# EAGLE design ChannelOutput-x2 (EAGLE 6.5.0)

## Sheet 1 of 2
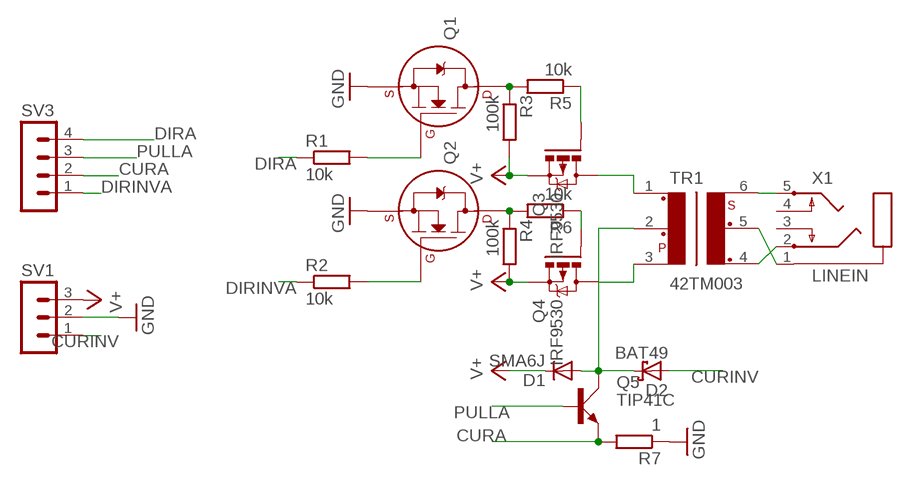
[diagram p0: schematic, sheet 1]

### Parts
D1  SMA6J  1N4004  [DO41-10]
D2  BAT49  [DO41-10]
Q1  2N7000_TO92  [TO-92]
Q2  2N7000_TO92  [TO-92]
Q3  IRF9530  [TO220BV]
Q4  IRF9530  [TO220BV]
Q5  TIP41C  [TO220AV]
R1  10k  R-EU_0207/2V  [0207/2V]
R2  10k  R-EU_0207/2V  [0207/2V]
R3  100k  R-EU_0204/5  [0204/5]
R4  100k  R-EU_0204/5  [0204/5]
R5  10k  R-EU_0207/2V  [0207/2V]
R6  10k  R-EU_0207/2V  [0207/2V]
R7  1  R-EU_0207/2V  [0207/2V]
SV1  MA03-1  [MA03-1]
SV3  MA04-1  [MA04-1]
TR1  42TM003  [42TM]
X1  LINEIN  PG203J  [PG203J]

### Nets
CURA: Q5.E R7.2 SV3.2
CURINV: D2.A SV1.1 ; also sheet 2
DIRA: R1.1 SV3.4
DIRINVA: R2.1 SV3.1
GND: Q1.1(S) Q2.1(S) R7.1 SV1.2 ; also sheet 2
N$1: Q1.2(G) R1.2
N$2: Q4.G R6.1
N$5: Q4.D TR1.3
N$6: Q3.D TR1.1
N$48: D1.A D2.C Q5.C TR1.2
N$65: TR1.6 X1.5
N$66: TR1.5 X1.1
N$67: TR1.4 X1.2
N$86: Q2.3(D) R4.1 R6.2
N$88: Q3.G R5.1
N$89: Q1.3(D) R3.1 R5.2
N$93: Q2.2(G) R2.2
PULLA: Q5.B SV3.3
V+: D1.C Q3.S Q4.S R3.2 R4.2 SV1.3 ; also sheet 2
Unconnected: X1.3 X1.4

## Sheet 2 of 2
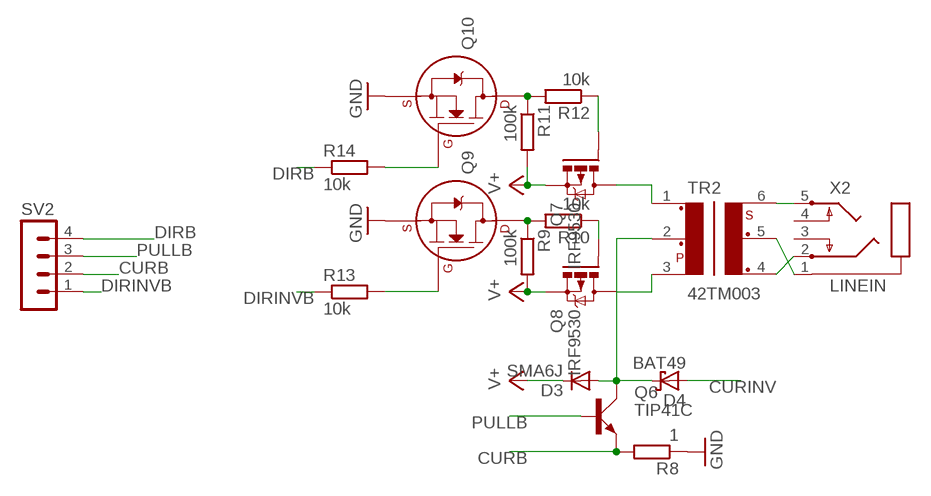
[diagram p1: schematic, sheet 2]

### Parts
D3  SMA6J  1N4004  [DO41-10]
D4  BAT49  [DO41-10]
Q6  TIP41C  [TO220AV]
Q7  IRF9530  [TO220BV]
Q8  IRF9530  [TO220BV]
Q9  2N7000_TO92  [TO-92]
Q10  2N7000_TO92  [TO-92]
R8  1  R-EU_0207/2V  [0207/2V]
R9  100k  R-EU_0204/5  [0204/5]
R10  10k  R-EU_0207/2V  [0207/2V]
R11  100k  R-EU_0204/5  [0204/5]
R12  10k  R-EU_0207/2V  [0207/2V]
R13  10k  R-EU_0207/2V  [0207/2V]
R14  10k  R-EU_0207/2V  [0207/2V]
SV2  MA04-1  [MA04-1]
TR2  42TM003  [42TM]
X2  LINEIN  PG203J  [PG203J]

### Nets
CURB: Q6.E R8.2 SV2.2
CURINV: D4.A ; also sheet 1
DIRB: R14.1 SV2.4
DIRINVB: R13.1 SV2.1
GND: Q9.1(S) Q10.1(S) R8.1 ; also sheet 1
N$8: D3.A D4.C Q6.C TR2.2
N$9: TR2.6 X2.5
N$10: TR2.5 X2.1
N$11: TR2.4 X2.2
N$13: Q9.3(D) R9.1 R10.2
N$15: Q7.G R12.1
N$16: Q10.3(D) R11.1 R12.2
N$17: Q9.2(G) R13.2
N$19: Q8.G R10.1
N$20: Q10.2(G) R14.2
N$23: Q8.D TR2.3
N$24: Q7.D TR2.1
PULLB: Q6.B SV2.3
V+: D3.C Q7.S Q8.S R9.2 R11.2 ; also sheet 1
Unconnected: X2.3 X2.4

## Library data of the parts
D1 D3 = diode:1N4004: DIODE general purpose rectifier, 1 A
D2 D4 = diode:BAT49: DIODE small signal diode
Q1 Q2 Q9 Q10 = transistors2:2N700*: 2N7000, 2N7002, NDS7002A N-channel enhancement mode MOSFET
Q3 Q4 Q7 Q8 = transistor-power:IRF9530: P-CHANNEL HEXFET POWER-MOS-FET Source: http://www.irf.com/product-info/datasheets/data/irf9530.pdf
Q5 Q6 = transistor-power:TIP41C: NPN TRANSISTOR
R1-R14 = resistor:R-EU_: RESISTOR, European symbol
SV1 = con-lstb:MA03-1: PIN HEADER; OC_FARNELL: unknown; OC_NEWARK: unknown
SV2 SV3 = con-lstb:MA04-1: PIN HEADER; OC_FARNELL: unknown; OC_NEWARK: unknown
TR1 TR2 = trafo-xicon:42T?*: Xicon Micro-Mini EI-12 Audio Transformers 42TL/42TC/42TM Series Source: http://www.mouser.com//catalog/specsheets/164201.pdf http://www.mouser.com/catalog/specsheets/114225.pdf http://www.mouser.com/catalog/specsheets/164267.pdf; OC_FARNELL: unknown; OC_NEWARK: unknown
X1 X2 = con-hirschmann:PG203J: MIC/HEADPHONE JACK KS-S stereo microphone/headphone jack PG203JN (Schukat); OC_FARNELL: unknown; OC_NEWARK: unknown

## Net classes
0 default: width 0.305 mm, clearance 0.205 mm

## Board
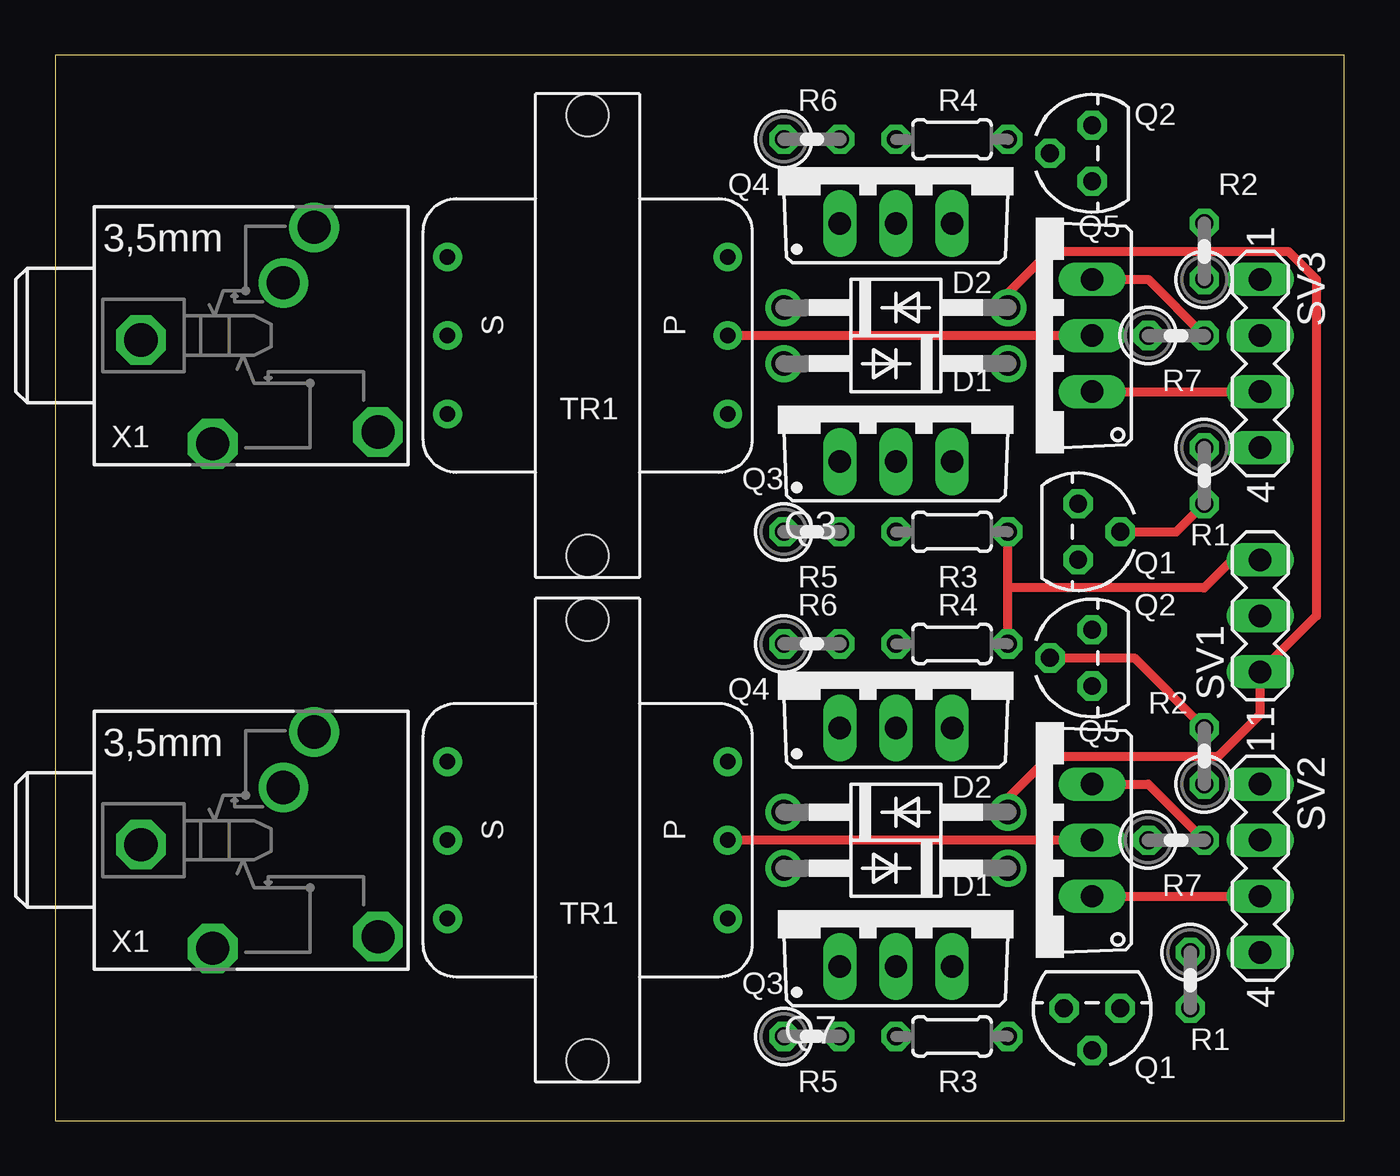
[diagram p2: board, top side]
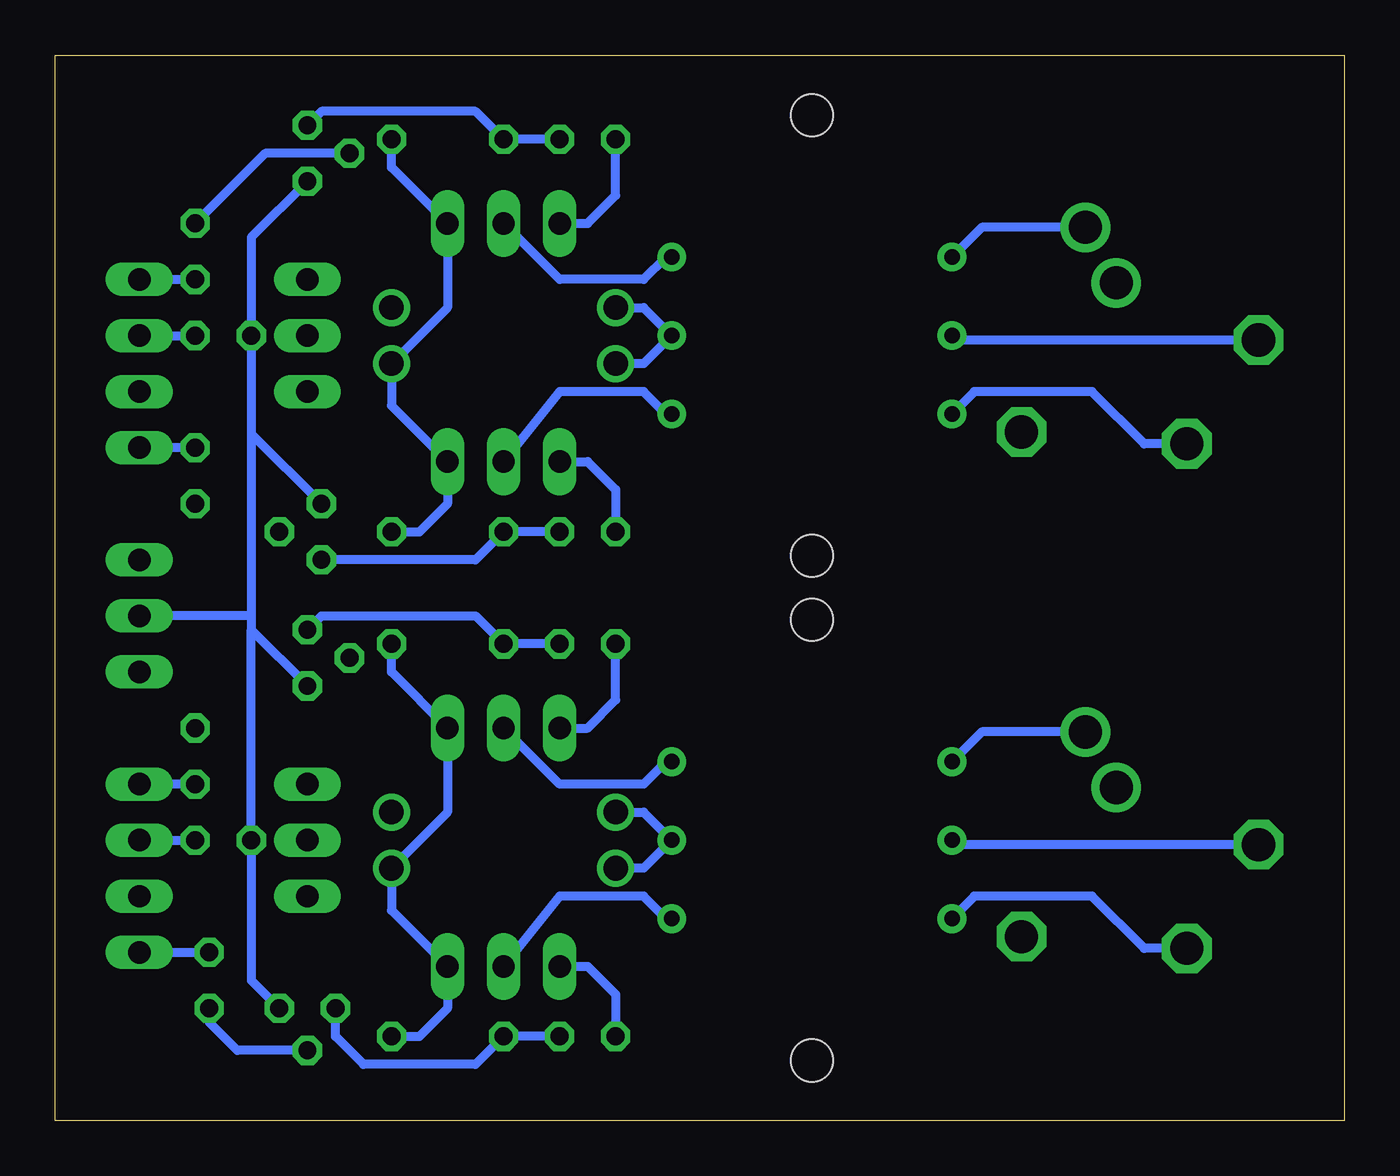
[diagram p3: board, bottom side, seen from below]

Size 58.42 x 48.26 mm. Coordinates in mm from the lower left corner, seen from the top.
Outline: 0,0 58.42,0 58.42,48.26 0,48.26 0,0
Copper layers (1*16): Top 0.035mm / dielectric 1.5mm / Bottom 0.035mm
Design rules "default": minimum track width 10mil, minimum drill 24mil, track to track 8mil, track to pad 8mil, pad to pad 8mil, via to via 8mil, smd to smd 8mil, copper to edge 40mil, drill to drill 8mil, minimum pad ring 10mil, minimum via ring 8mil, stop-mask expansion 4mil, vias tented up to drill 0mil, thermal gap 10mil

### Footprints (pad centres in the part's own frame; a part is rotated, then mirrored left to right if it is on the bottom)
DO41-10 = drill 1.118: A 5.08,0; C -5.08,0
TO-92 = drill 0.813 octagon: 1 -1.27,0; 2 0,1.905; 3 1.27,0
TO220BV = drill 1.016 long: D 0,-2.54; G -2.54,-2.54; S 2.54,-2.54
TO220AV = drill 1.016 long: B -2.54,-2.54; C 0,-2.54; E 2.54,-2.54
0207/2V = drill 0.813 octagon: 1 -1.27,0; 2 1.27,0
0204/5 = drill 0.813 octagon: 1 -2.54,0; 2 2.54,0
MA03-1 = drill 1.016 long: 1 -2.54,0; 2 0,0; 3 2.54,0
MA04-1 = drill 1.016 long: 1 -3.81,0; 2 -1.27,0; 3 1.27,0; 4 3.81,0
42TM = drill 0.7 pad 1.3: 1 -3.556,-6.35; 2 0,-6.35; 3 3.556,-6.35; 4 3.556,6.35; 5 0,6.35; 6 -3.556,6.35 | hole 1.9: -9.982,0; 9.982,0
PG203J = drill 1.499 octagon: 1 -5.004,-0.203; 4 5.74,-4.369; 5 -1.753,-4.902 | drill 1.499: 2 2.845,4.902; 3 1.448,2.388

### Placement (x,y rotation side)
D1  38.1,34.29 180 top
D2  38.1,36.83 0 top
D3  38.1,11.43 180 top
D4  38.1,13.97 0 top
Q1  46.35,26.67 270 top
Q2  46.99,43.81 90 top
Q3  38.1,32.38 0 top
Q4  38.1,43.18 0 top
Q5  44.45,35.56 90 top
Q6  44.45,12.7 90 top
Q7  38.1,9.53 0 top
Q8  38.1,20.32 0 top
Q9  46.99,20.95 90 top
Q10  46.99,5.08 180 top
R1  52.07,29.21 270 top
R2  52.07,39.37 90 top
R3  40.64,26.67 0 top
R4  40.64,44.45 0 top
R5  34.29,26.67 0 top
R6  34.29,44.45 0 top
R7  50.8,35.56 0 top
R8  50.8,12.7 0 top
R9  40.64,21.59 0 top
R10  34.29,21.59 0 top
R11  40.64,3.81 0 top
R12  34.29,3.81 0 top
R13  52.07,16.51 90 top
R14  51.44,6.35 270 top
SV1  54.61,22.86 90 top
SV2  54.61,11.43 270 top
SV3  54.61,34.29 270 top
TR1  24.13,35.56 90 top
TR2  24.13,12.7 90 top
X1  8.89,35.56 0 top
X2  8.89,12.7 0 top

### Tracks (layer width: path | path; a pad name or v marks a point on that pad's centre or on a via)
CURA
  Top 0.406: Q5.E 49.53,38.1 R7.2
  Bottom 0.406: SV3.2 R7.2
CURB
  Top 0.406: Q6.E 49.53,15.24 R8.2
  Bottom 0.406: SV2.2 R8.2
CURINV
  Top 0.406: D4.A 43.18,14.61 45.09,16.51 52.7,16.51 54.61,18.41 SV1.1 57.15,22.86 57.15,38.1 55.88,39.37 45.09,39.37 43.18,37.47 D2.A
DIRA
  Bottom 0.406: R1.1 SV3.4
DIRB
  Bottom 0.406: SV2.4 R14.1
DIRINVA
  Bottom 0.406: SV3.1 R2.1
DIRINVB
  Bottom 0.406: R13.1 SV2.1
GND
  Bottom 0.406: Q10.1 49.53,6.35 R8.1 49.53,22.23 | Q2.1 49.53,40.01 R7.1 49.53,31.11 | 49.53,31.11 Q1.1 | 49.53,31.11 49.53,22.86 | 49.53,22.86 SV1.2 | 49.53,22.86 49.53,22.23 | 49.53,22.23 Q9.1
N$1
  Top 0.406: Q1.2 50.8,26.67 R1.2
N$2
  Bottom 0.406: Q4.G 34.29,40.64 33.02,41.91 R6.1
N$5
  Bottom 0.406: TR1.3 30.73,39.12 31.75,38.1 35.56,38.1 Q4.D
N$6
  Bottom 0.406: TR1.1 30.73,32 31.75,33.02 35.56,33.02 Q3.D
N$8
  Top 0.406: Q6.C TR2.2
  Bottom 0.406: D4.C 31.75,13.97 TR2.2 31.75,11.43 D3.A
N$9
  Bottom 0.406: X2.5 9.07,7.8 11.43,10.16 16.76,10.16 TR2.6
N$10
  Bottom 0.406: X2.1 17.58,12.5 TR2.5
N$11
  Bottom 0.406: X2.2 16.43,17.6 TR2.4
N$13
  Bottom 0.406: R10.2 R9.1 39.37,22.86 46.35,22.86 Q9.3
N$15
  Bottom 0.406: 33.02,4.45 R12.1 33.02,5.71 34.29,6.99 Q7.G
N$16
  Bottom 0.406: R12.2 R11.1 39.37,2.54 44.45,2.54 45.72,3.81 Q10.3
N$17
  Top 0.406: Q9.2 48.9,20.95 R13.2
N$19
  Bottom 0.406: Q8.G 34.29,17.78 33.02,19.05 R10.1
N$20
  Bottom 0.406: Q10.2 50.16,3.17 51.44,4.45 R14.2
N$23
  Bottom 0.406: TR2.3 30.73,16.26 31.75,15.24 35.56,15.24 Q8.D
N$24
  Bottom 0.406: TR2.1 30.73,9.14 31.75,10.16 35.56,10.16 Q7.D
N$48
  Top 0.406: Q5.C TR1.2
  Bottom 0.406: D2.C 31.75,36.83 TR1.2 31.75,34.29 D1.A
N$65
  Bottom 0.406: X1.5 9.07,30.66 11.43,33.02 16.76,33.02 TR1.6
N$66
  Bottom 0.406: X1.1 17.58,35.36 TR1.5
N$67
  Bottom 0.406: X1.2 16.43,40.46 TR1.4
N$86
  Bottom 0.406: R6.2 R4.1 39.37,45.72 46.35,45.72 Q2.3
N$88
  Bottom 0.406: 33.02,27.3 R5.1 33.02,28.57 34.29,29.84 Q3.G
N$89
  Bottom 0.406: R5.2 R3.1 39.37,25.4 Q1.3
N$93
  Bottom 0.406: Q2.2 48.9,43.81 R2.2
PULLA
  Top 0.406: Q5.B SV3.3
PULLB
  Top 0.406: Q6.B SV2.3
V+
  Top 0.406: R9.2 43.18,24.13 | 43.18,24.13 R3.2 | SV1.3 53.34,25.4 52.07,24.13 43.18,24.13
  Bottom 0.406: R4.2 43.18,43.18 Q4.S 40.64,36.83 D1.C 43.18,32.38 Q3.S 40.64,27.94 41.91,26.67 R3.2 | R9.2 43.18,20.32 Q8.S 40.64,13.97 D3.C 43.18,9.53 Q7.S 40.64,5.08 41.91,3.81 R11.2

### Text on the board
tNames: R6 | R4 | Q2 | Q4 | R2 | Q5 | D2 | D1 | R7 | TR1 | X1 | Q3 | R1 | Q1 | R5 | R3 | R6 | R4 | Q2 | Q4 | R2 | Q5 | D2 | D1 | R7 | TR1 | X1 | Q3 | R1 | Q1 | R5 | R3